# EAGLE design charge controller (EAGLE 9.3.2)
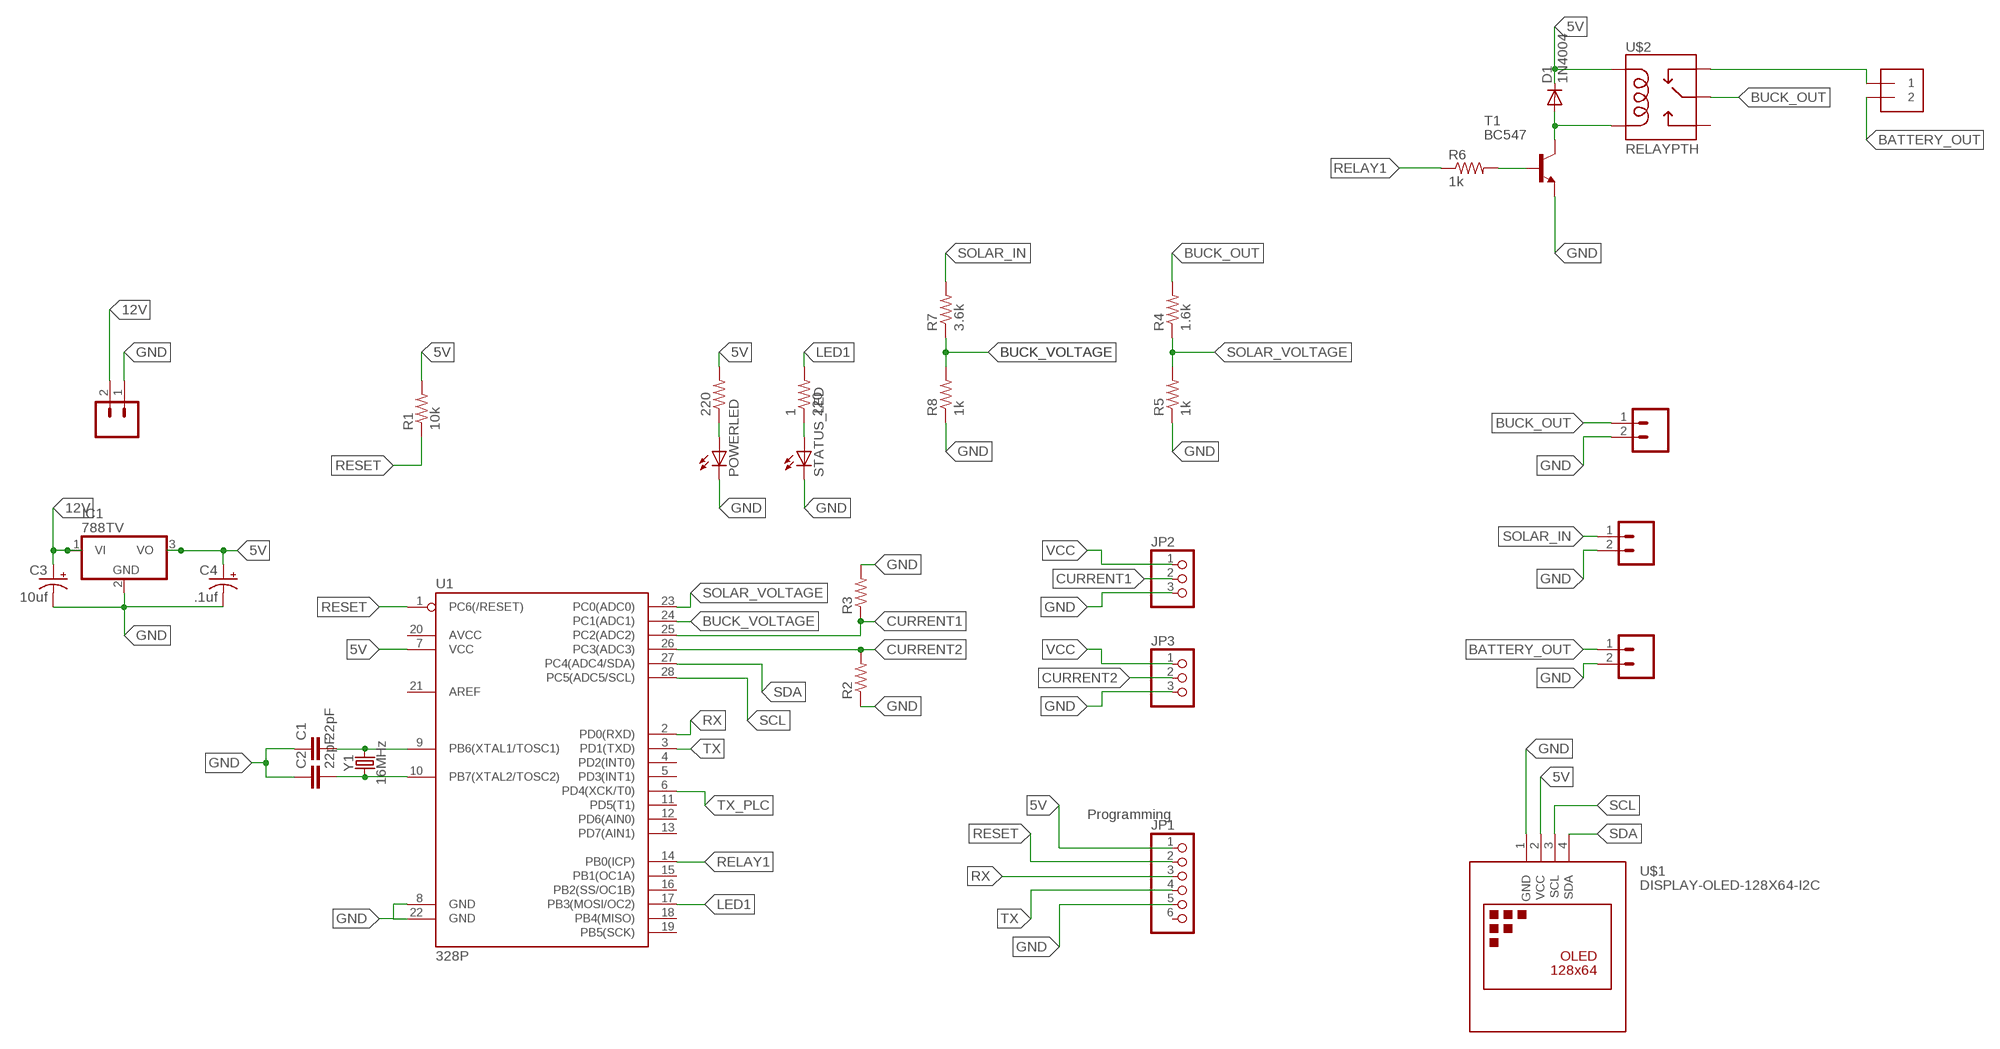
[diagram p0: schematic, sheet 1]

## Parts
1  220  R-US_0207/7  [0207/7]
220  R-US_0207/7  [0207/7]
BAT_OUT  1X2-3.5MM  [1X2-3.5MM]
BATTERY-OUT  CONN_025MM  [SCREWTERMINAL-5MM-2]
BUCK-OUT  CONN_025MM  [SCREWTERMINAL-5MM-2]
C1  22pF  22PF-PTH-2.54MM-200V-5%  [CAP-PTH-2.54]
C2  22pF  22PF-PTH-2.54MM-200V-5%  [CAP-PTH-2.54]
C3  10uf  CPOL-USE5-5  [E5-5]
C4  .1uf  CPOL-USE5-5  [E5-5]
D1  1N4004  [DO41-10]
IC1  788TV  [TO220V]
J1  CONN_025MM  [SCREWTERMINAL-5MM-2]
JP1  PINHD-1X6  [1X06]
JP2  PINHD-1X3  [1X03]
JP3  PINHD-1X3  [1X03]
POWERLED  LED5MM  [LED5MM]
R1  10k  R-US_0207/7  [0207/7]
R2  R-US_0207/7  [0207/7]
R3  R-US_0207/15  [0207/15]
R4  1.6k  R-US_0207/7  [0207/7]
R5  1k  R-US_0207/7  [0207/7]
R6  1k  R-US_0207/7  [0207/7]
R7  3.6k  R-US_0207/7  [0207/7]
R8  1k  R-US_0207/7  [0207/7]
SOLAR-IN  CONN_025MM  [SCREWTERMINAL-5MM-2]
STATUS_LED  LED5MM  [LED5MM]
T1  BC547  [TO92]
U1  328P  ATMEGA328P_PDIP  [DIP28]
U$1  DISPLAY-OLED-128X64-I2C  [DISPLAY-OLED-128X64-I2C]
U$2  RELAYPTH  [SRD-05VDC-SL-C]
Y1  16MHz  CRYSTAL-16MHZPTH-HC49US  [HC49US]

## Nets
5V: 220.2 C4.+ D1.C IC1.3(VO) JP1.1 R1.2 U1.7(VCC) U$1.2(VCC) U$2.COIL1
12V: C3.+ IC1.1(VI) J1.2
BATTERY_OUT: BAT_OUT.2 BATTERY-OUT.1
BUCK_OUT: BUCK-OUT.1 R4.2 U$2.SWCOMMON
BUCK_VOLTAGE: R7.1 R8.2 U1.24(PC1(ADC1))
CURRENT1: JP2.2 R3.1 U1.25(PC2(ADC2))
CURRENT2: JP3.2 R2.2 U1.26(PC3(ADC3))
GND: BATTERY-OUT.2 BUCK-OUT.2 C1.1 C2.1 C3.- C4.- IC1.2(GND) J1.1 JP1.5 JP2.3 JP3.3 POWERLED.K(C) R2.1 R3.2 R5.1 R8.1 SOLAR-IN.2 STATUS_LED.K(C) T1.1(E) U1.8(GND) U1.22(GND) U$1.1(GND)
LED1: 1.2 U1.17(PB3(MOSI/OC2))
N$1: 220.1 POWERLED.A
N$2: C1.2 U1.9(PB6(XTAL1/TOSC1)) Y1.2
N$3: C2.2 U1.10(PB7(XTAL2/TOSC2)) Y1.1
N$5: 1.1 STATUS_LED.A
N$6: R6.2 T1.2(B)
N$7: D1.A T1.3(C) U$2.COIL0
N$9: BAT_OUT.1 U$2.SWCLOSED(SWCLOSE)
RELAY1: R6.1 U1.14(PB0(ICP))
RESET: JP1.2 R1.1 U1.1(PC6(/RESET))
RX: JP1.3 U1.2(PD0(RXD))
SCL: U1.28(PC5(ADC5/SCL)) U$1.3(SCL)
SDA: U1.27(PC4(ADC4/SDA)) U$1.4(SDA)
SOLAR_IN: R7.2 SOLAR-IN.1
SOLAR_VOLTAGE: R4.1 R5.2 U1.23(PC0(ADC0))
TX: JP1.4 U1.3(PD1(TXD))
TX_PLC: U1.6(PD4(XCK/T0))
VCC: JP2.1 JP3.1
Unconnected: JP1.6 U1.4(PD2(INT0)) U1.5(PD3(INT1)) U1.11(PD5(T1)) U1.12(PD6(AIN0)) U1.13(PD7(AIN1)) U1.15(PB1(OC1A)) U1.16(PB2(SS/OC1B)) U1.18(PB4(MISO)) U1.19(PB5(SCK)) U1.20(AVCC) U1.21(AREF) U$2.SWOPEN

## Notes on the sheet
- Programming

## Library data of the parts
1 220 R1-R8 = adafruit:R-US_: RESISTOR, American symbol
BAT_OUT = adafruit:1X2: 3.5mm Terminal block http://www.ladyada.net/library/pcb/eaglelibrary.html
BATTERY-OUT BUCK-OUT J1 SOLAR-IN = SparkFun-Connectors:CONN_02: Multi connection point. Often used as Generic Header-pin footprint for 0.1 inch spaced/style header connections On any of the 0.1 inch spaced packages, you can populate with these: Break Away Headers - Straight <https://www.sparkfun.com/products/116> (PRT-00116) Break Away Male Headers - Right Angle <https://www.sparkfun.com/products/553> (PRT-00553) Female Headers <https://www.sparkfun.com/products/115> (PRT-00115) Break Away Headers - Machine Pin <https://www.sparkfun.com/products/117> (PRT-00117) Break Away Female Headers - Swiss Machine Pin <https://www.sparkfun.com/products/743> (PRT-00743) For SCREWTERMINALS and SPRING TERMINALS visit here: Screw Terimnals on SparkFun.com <https://www.sparkfun.com/search/results?term=Screw+Terminals> (5mm/3.5mm/2.54mm spacing) This device is also useful as a general connection point to wire up your design to another part of your project. Our various solder wires solder well into these plated through hole pads. Hook-Up Wire - Assortment (Stranded, 22 AWG) <https://www.sparkfun.com/products/11375> (PRT-11375) Hook-Up Wire - Assortment (Solid Core, 22 AWG) <https://www.sparkfun.com/products/11367> (PRT-11367) View the entire wire category on our website here <https://www.sparkfun.com/categories/141> Special notes: Molex polarized connector foot print use with: PRT-08233 with associated crimp pins and housings. 2.54_SCREWTERM for use with PRT-10571. 3.5mm Screw Terminal footprints for PRT-08084 5mm Screw Terminal footprints for use with PRT-08432; SF_SKU: PRT-08432
C1 C2 = SparkFun-Capacitors:22PF: 22pF ceramic capacitors A capacitor is a passive two-terminal electrical component used to store electrical energy temporarily in an electric field.; PROD_ID: CAP-09128
C3 C4 = adafruit:CPOL-US: POLARIZED CAPACITOR, American symbol
D1 = adafruit:1N4004: DIODE General purpose 1N400x type rectifier (With bigger pads) http://www.ladyada.net/library/pcb/eaglelibrary.html
IC1 = linear:78*: Positive VOLTAGE REGULATOR Source: http://cache.national.com/ds/LM/LM78L05.pdf http://www.fairchildsemi.com/ds/LM/LM7805.pdf
JP1 = adafruit:PINHD-1X6: PIN HEADER
JP2 JP3 = adafruit:PINHD-1X3: PIN HEADER
POWERLED STATUS_LED = adafruit:LED: LED OSRAM: - CHIPLED LG R971, LG N971, LY N971, LG Q971, LY Q971, LO R971, LY R971 LH N974, LH R974 LS Q976, LO Q976, LY Q976 LO Q996 - Hyper CHIPLED LW Q18S LB Q993, LB Q99A, LB R99A - SideLED LS A670, LO A670, LY A670, LG A670, LP A670 LB A673, LV A673, LT A673, LW A673 LH A674 LY A675 LS A676, LA A676, LO A676, LY A676, LW A676 LS A679, LY A679, LG A679 - Hyper Micro SIDELED® LS Y876, LA Y876, LO Y876, LY Y876 LT Y87S - SmartLED LW L88C, LW L88S LB L89C, LB L89S, LG L890 LS L89K, LO L89K, LY L89K LS L896, LA L896, LO L896, LY L896 - TOPLED LS T670, LO T670, LY T670, LG T670, LP T670 LSG T670, LSP T670, LSY T670, LOP T670, LYG T670 LG T671, LOG T671, LSG T671 LB T673, LV T673, LT T673, LW T673 LH T674 LS T676, LA T676, LO T676, LY T676, LB T676, LH T676, LSB T676, LW T676 LB T67C, LV T67C, LT T67C, LS T67K, LO T67K, LY T67K, LW E67C LS E67B, LA E67B, LO E67B, LY E67B, LB E67C, LV E67C, LT E67C LW T67C LS T679, LY T679, LG T679 LS T770, LO T770, LY T770, LG T770, LP T770 LB T773, LV T773, LT T773, LW T773 LH T774 LS E675, LA E675, LY E675, LS T675 LS T776, LA T776, LO T776, LY T776, LB T776 LHGB T686 LT T68C, LB T68C - Hyper Mini TOPLED® LB M676 - Mini TOPLED Santana® LG M470 LS M47K, LO M47K, LY M47K Source: http://www.osram.convergy.de/
T1 = transistor:BC547: NPN TRANSISTOR
U1 = SparkFun-IC-Microcontroller:ATMEGA328P_PDIP: Atmel 328P Through hole ATMEGA328P uC used in the Arduino 32kb flash, 1k EEPROM, 2k SRAM Datasheet <http://www.sparkfun.com/datasheets/Components/SMD/ATMega328.pdf> SparkFun Products Storefront component: AVR 28 Pin 20MHz 32K 6A/D - ATMega328P <https://www.sparkfun.com/products/9061> (COM-09061) SparkFun Simon Says - Through-Hole Soldering Kit <https://www.sparkfun.com/products/10547> (KIT-10547) SparkFun Learn to Solder - Simon Says <https://www.sparkfun.com/products/13708> (KIT-13708) SparkFun BigTime Watch Kit <https://www.sparkfun.com/products/11734> (KIT-11734) SparkFun ClockIt <https://www.sparkfun.com/products/10930> (KIT-10930) SparkFun Serial Enabled LCD Kit <https://www.sparkfun.com/products/10097> (LCD-10097) SparkFun Simon Tilts - Through Hole Soldering Kit <https://www.sparkfun.com/products/12634> (KIT-12634) SparkFun Frequency Counter Kit <https://www.sparkfun.com/products/10140> (KIT-10140) FabFM Radio Kit <https://www.sparkfun.com/products/11043> (KIT-11043) SparkFun Binary Blaster Kit <https://www.sparkfun.com/products/12037> (KIT-12037) SparkFun Metro-Gnome <https://www.sparkfun.com/products/9236> (KIT-09236) ATmega328 with Arduino Optiboot (Uno) <https://www.sparkfun.com/products/10524> (DEV-10524); PROD_ID: IC-09136
U$1 = diy-modules:DISPLAY-OLED-128X64-I2C: 128x64 Dot Matrix OLED Module based on SSD1306 chip Variant with I2C interface More details available here: http://www.instructables.com/id/Monochrome-096-i2c-OLED-display-with-arduino-SSD13/ SSD1306 datasheet: https://cdn-shop.adafruit.com/datasheets/SSD1306.pdf Click here to find device on ebay.com <http://www.ebay.com/sch/oled+display+128x64+iic> Note: There are two variants: I2C and SPI. Search for the proper version.
U$2 = SRD-05VDC-SL-C:RELAY: SPDT relay (COM-00101)
Y1 = SparkFun-Clocks:CRYSTAL-16MHZ: 16MHz Crystal Digikey Example <http://www.digikey.com/product-search/en?keywords=535-9122-1-ND> Frequency: 16MHz Frequency Stability: ±50ppm Frequency Tolerance: ±20ppm Load Capacitance: 18pF SparkFun Products: Pro Micro -5V/16MHz <https://www.sparkfun.com/products/12640> SparkFun Serial Enabled LCD Kit <https://www.sparkfun.com/products/10097>; PROD_ID: XTAL-08181; SF_ID: COM-00536

## Board
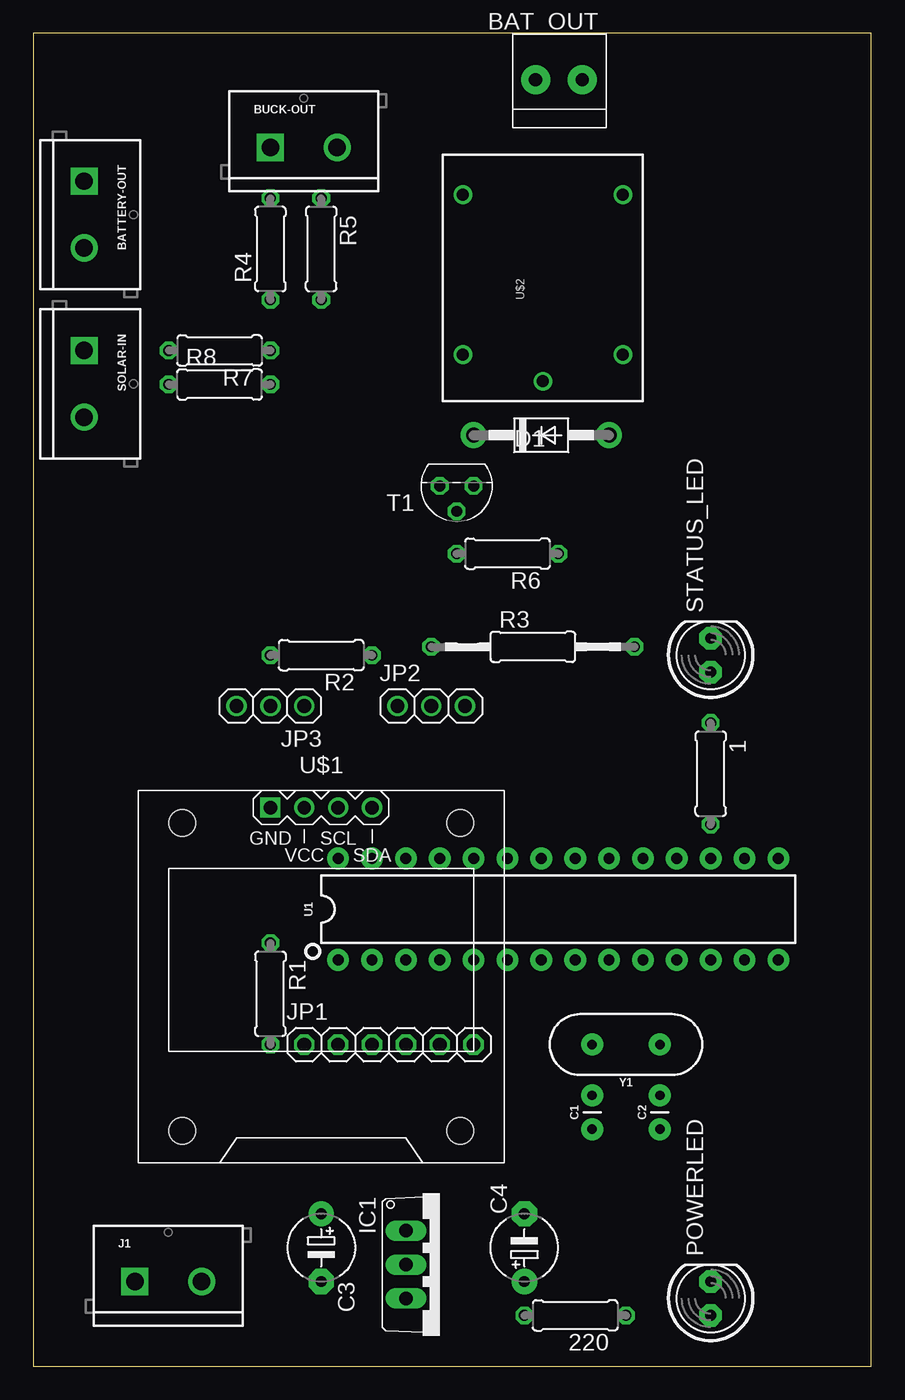
[diagram p1: board, top side]
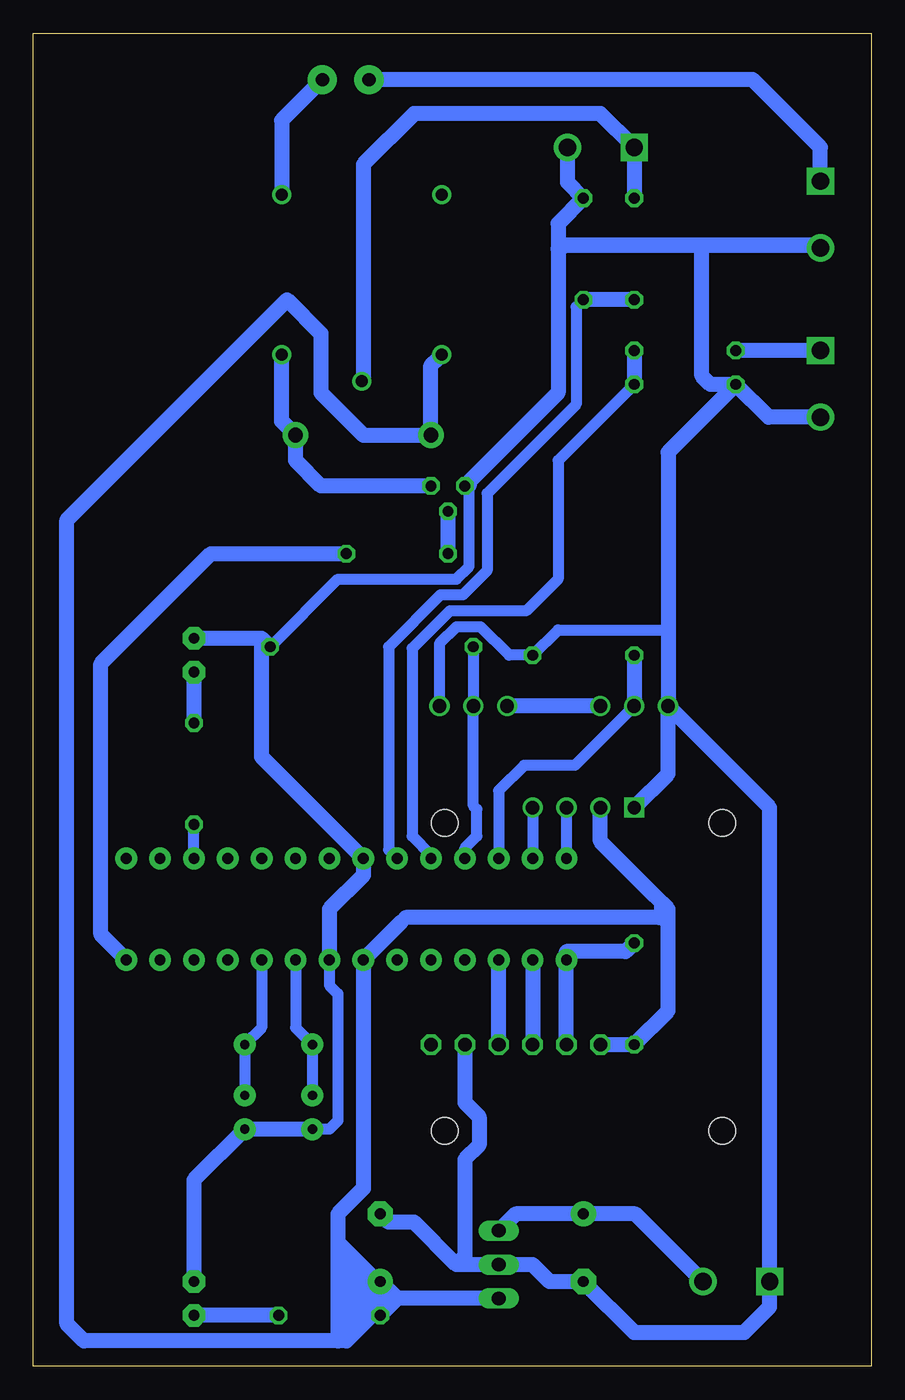
[diagram p2: board, bottom side, seen from below]

Size 62.84 x 100 mm. Coordinates in mm from the lower left corner, seen from the top.
Outline: 0,0 62.84,0 62.84,100 0,100 0,0
Copper layers (1*16): Top 0.035mm / dielectric 1.5mm / Bottom 0.035mm
Design rules "default *": minimum track width 20mil, minimum drill 0.35mm, track to track 15mil, track to pad 15mil, pad to pad 15mil, via to via 6mil, smd to smd 6mil, copper to edge 40mil, drill to drill 6mil, minimum pad ring 10mil, minimum via ring 8mil, stop-mask expansion 4mil, vias tented up to drill 0mil, thermal gap 10mil

### Footprints (pad centres in the part's own frame; a part is rotated, then mirrored left to right if it is on the bottom)
0207/7 = drill 0.813 octagon: 1 -3.81,0; 2 3.81,0
1X2-3.5MM = drill 1 pad 2.184: 1 1.8,0; 2 -1.7,0
SCREWTERMINAL-5MM-2 = drill 1.3 pad 2.032 square: 1 0,0 | drill 1.3 pad 2.032: 2 5,0
CAP-PTH-2.54 = drill 0.7 pad 1.651: 1 -1.27,0; 2 1.27,0
E5-5 = drill 0.813 pad 1.905: + -2.54,0 | drill 0.813 pad 1.905 octagon: - 2.54,0
DO41-10 = drill 1.118 pad 1.93: A 5.08,0; C -5.08,0
TO220V = drill 1.016 long: 1 -2.54,-2.54; 2 0,-2.54; 3 2.54,-2.54
1X06 = drill 1.016 octagon: 1 -6.35,0; 2 -3.81,0; 3 -1.27,0; 4 1.27,0; 5 3.81,0; 6 6.35,0
1X03 = drill 1.016: 1 -2.54,0; 2 0,0; 3 2.54,0
LED5MM = drill 0.813 pad 1.676 octagon: A -1.27,0; K 1.27,0
0207/15 = drill 0.813 octagon: 1 -7.62,0; 2 7.62,0
TO92 = drill 0.813 octagon: 1 1.27,0; 2 0,1.905; 3 -1.27,0
DIP28 = drill 0.813 pad 1.626: 1 -16.51,-3.81; 2 -13.97,-3.81; 3 -11.43,-3.81; 4 -8.89,-3.81; 5 -6.35,-3.81; 6 -3.81,-3.81; 7 -1.27,-3.81; 8 1.27,-3.81; 9 3.81,-3.81; 10 6.35,-3.81; 11 8.89,-3.81; 12 11.43,-3.81; 13 13.97,-3.81; 14 16.51,-3.81; 15 16.51,3.81; 16 13.97,3.81; 17 11.43,3.81; 18 8.89,3.81; 19 6.35,3.81; 20 3.81,3.81; 21 1.27,3.81; 22 -1.27,3.81; 23 -3.81,3.81; 24 -6.35,3.81; 25 -8.89,3.81; 26 -11.43,3.81; 27 -13.97,3.81; 28 -16.51,3.81
DISPLAY-OLED-128X64-I2C = drill 1 square: 1 -3.81,12.7 | drill 1: 2 -1.27,12.7; 3 1.27,12.7; 4 3.81,12.7 | hole 2: -10.414,11.557; 10.414,11.557; 10.414,-11.557; -10.414,-11.557
SRD-05VDC-SL-C = drill 0.9: COIL0 -5.39,-6.12; COIL1 -5.39,5.88; SWCLOSED 6.61,-6.12; SWCOMMON -7.39,-0.12; SWOPEN 6.61,5.88
HC49US = drill 0.7 pad 1.651: 1 -2.54,0; 2 2.54,0

### Placement (x,y rotation side)
1  50.8,44.45 270 top
220  40.64,3.81 180 top
BAT_OUT  39.37,96.52 0 top
BATTERY-OUT  3.81,88.9 270 top
BUCK-OUT  17.78,91.44 0 top
C1  41.91,19.05 90 top
C2  46.99,19.05 90 top
C3  21.59,8.89 270 top
C4  36.83,8.89 90 top
D1  38.1,69.85 0 top
IC1  30.48,7.62 270 top
J1  7.62,6.35 0 top
JP1  26.67,24.13 0 top
JP2  29.84,49.53 0 top
JP3  17.78,49.53 180 top
POWERLED  50.8,5.08 90 top
R1  17.78,27.94 270 top
R2  21.59,53.34 180 top
R3  37.47,53.98 0 top
R4  17.78,83.82 90 top
R5  21.59,83.82 270 top
R6  35.56,60.96 180 top
R7  13.97,76.2 180 top
R8  13.97,73.66 0 top
SOLAR-IN  3.81,76.2 270 top
STATUS_LED  50.8,53.34 90 top
T1  31.75,66.04 180 top
U1  39.37,34.29 0 top
U$1  21.59,29.21 0 top
U$2  38.1,81.28 90 top
Y1  44.45,24.13 180 top

### Tracks (layer width: path | path; a pad name or v marks a point on that pad's centre or on a via)
5V
  Bottom 0.813: 34.92,33.66 35.24,33.34 | 40.01,11.43 40.01,9.53 C4.+ | 15.24,26.67 15.24,33.02 15.88,33.66 15.88,34.92 16.19,35.24 | 32.47,75.64 U$2.COIL1
  Bottom 1.143: IC1.3 35.56,5.08 | 35.56,5.08 C4.+ 36.83,5.08 | 36.83,5.08 220.2 | 220.2 35.56,5.08 | 32.47,75.64 33.02,75.09 D1.C 38.1,69.85 41.27,73.03 41.27,77.47 43.81,80.01 60.33,63.5 60.33,3.17 59.05,1.91 40.01,1.91 | 220.2 37.47,3.81 39.37,1.91 | 39.37,1.91 40.01,1.91 | JP1.1 R1.2 15.24,26.67 15.24,34.29 16.19,35.24 20.32,39.37 U$1.2 | 15.88,33.66 34.92,33.66 | 35.24,33.34 U1.7 38.1,13.34 40.01,11.43 40.01,8.26 | 40.01,8.26 40.01,6.99 | 40.01,6.99 40.01,5.08 | 40.01,5.08 40.01,2.54 39.37,1.91 | 40.01,1.91 37.15,4.76 | 37.15,4.76 36.83,5.08 | 37.15,5.4 36.83,5.08 | 40.01,8.26 38.73,6.99 | 37.15,5.4 38.42,4.13 38.73,4.45 38.73,5.08 | 37.15,4.76 37.15,5.4 | 37.15,5.4 38.73,6.99 | 37.15,4.76 37.47,5.08 38.73,5.08 | 38.73,5.08 39.37,4.45 39.37,3.17 | 38.73,5.08 38.73,5.71 | 38.73,5.71 38.73,6.99 | 40.01,6.99 38.73,5.71 | 38.73,5.71 39.37,5.71 40.01,5.08
12V
  Bottom 1.143: J1.2 17.7,11.43 C3.+ 26.67,11.43 IC1.1
BATTERY_OUT
  Bottom 1.143: BATTERY-OUT.1 3.81,91.44 8.89,96.52 BAT_OUT.2
BUCK_OUT
  Bottom 0.508: 38.1,74.3 U$2.SWCOMMON
  Bottom 1.143: R4.2 BUCK-OUT.1 20.32,93.98 34.29,93.98 38.1,90.17 38.1,74.3
BUCK_VOLTAGE
  Bottom 0.813: R8.2 23.5,67.94 23.5,59.05 25.88,56.67 31.61,56.67 34.43,53.85 34.43,39.76 33.02,38.36 U1.24
  Bottom 1.143: R7.1 R8.2
CURRENT1
  Bottom 0.813: R3.1 JP2.2 29.84,42.03 29.58,41.77 29.58,39.76 30.48,38.87 U1.25
CURRENT2
  Bottom 0.813: JP3.2 22.23,45.09 26.04,45.09 27.94,43.18 U1.26
  Bottom 1.143: R2.2 JP3.2
GND
  Bottom 0.508: 30.16,66.36 T1.1 | 23.5,84.45 3.81,84.45 BATTERY-OUT.2
  Bottom 0.813: U1.22 39.37,39.37 | BATTERY-OUT.2 12.7,83.9 22.94,83.9 23.5,84.45 | 23.5,84.45 23.5,85.72 | 23.5,84.45 23.5,83.82 | 23.5,73.03 T1.1 30.16,66.04 30.16,60.01 31.11,59.05 40.01,59.05 R3.2 | U1.8 40.64,28.57 40.01,27.94 40.01,18.41 40.64,17.78 C1.1 | 15.24,55.24 23.5,55.24 R2.1 27.16,53.34 29.3,55.47 31.11,55.47 32.38,54.2 JP2.3
  Bottom 1.143: 31.11,7.62 IC1.2 25.4,7.62 24.13,6.35 C3.- 17.78,2.54 9.53,2.54 7.62,4.45 J1.1 7.62,41.91 JP3.3 | 31.11,7.62 34.29,10.79 36.2,10.79 C4.- | 31.11,7.62 30.48,8.26 30.48,15.52 29.42,16.58 29.42,18.73 30.48,19.79 JP1.5 | U1.8 40.64,34.29 38.1,36.83 U1.22 45.72,45.72 45.72,53.98 R3.2 45.72,54.61 STATUS_LED.K | POWERLED.K 50.8,13.97 C2.1 C1.1 | R8.1 12.06,73.66 12.7,74.3 12.7,83.9 | SOLAR-IN.2 7.7,71.2 R8.1 | R8.1 15.24,68.58 15.24,55.24 JP3.3 | U$1.1 15.24,44.45 JP3.3 | BUCK-OUT.2 22.78,88.82 R5.1 23.5,85.72 23.5,83.82 23.5,73.03 30.16,66.36 30.16,66.04
LED1
  Bottom 0.813: U1.17 1.2
N$1
  Bottom 1.143: 220.1 POWERLED.A
N$2
  Bottom 0.813: U1.9 43.18,25.4 Y1.2 C1.2
N$3
  Bottom 0.813: U1.10 45.72,25.4 Y1.1 C2.2
N$5
  Bottom 1.143: STATUS_LED.A 1.1
N$6
  Bottom 1.143: T1.2 R6.2
N$7
  Bottom 0.813: 44.22,75.56 U$2.COIL0
  Bottom 1.143: 44.22,75.56 44.22,70.89 D1.A 43.18,67.94 41.27,66.04 T1.3
N$9
  Bottom 1.143: BAT_OUT.1 44.22,93.47 U$2.SWCLOSED
RELAY1
  Bottom 1.143: U1.14 57.78,32.38 57.78,52.7 49.53,60.96 R6.1
RESET
  Bottom 0.508: 22.86,31.11 U1.1 JP1.2
  Bottom 1.143: JP1.2 22.86,31.11 18.41,31.11 R1.1
RX
  Bottom 1.143: U1.2 JP1.3
SCL
  Bottom 0.813: U$1.3 U1.28
SDA
  Bottom 0.813: U$1.4 U1.27
SOLAR_IN
  Bottom 1.143: SOLAR-IN.1 R7.2
SOLAR_VOLTAGE
  Bottom 0.813: R5.2 22.14,79.46 22.14,72.14 28.8,65.48 28.8,59.68 30.62,57.86 32.31,57.86 36.2,53.98 36.2,38.73 U1.23
  Bottom 1.143: R4.1 R5.2
TX
  Bottom 1.143: JP1.4 U1.3
VCC
  Bottom 1.143: JP3.1 JP2.1